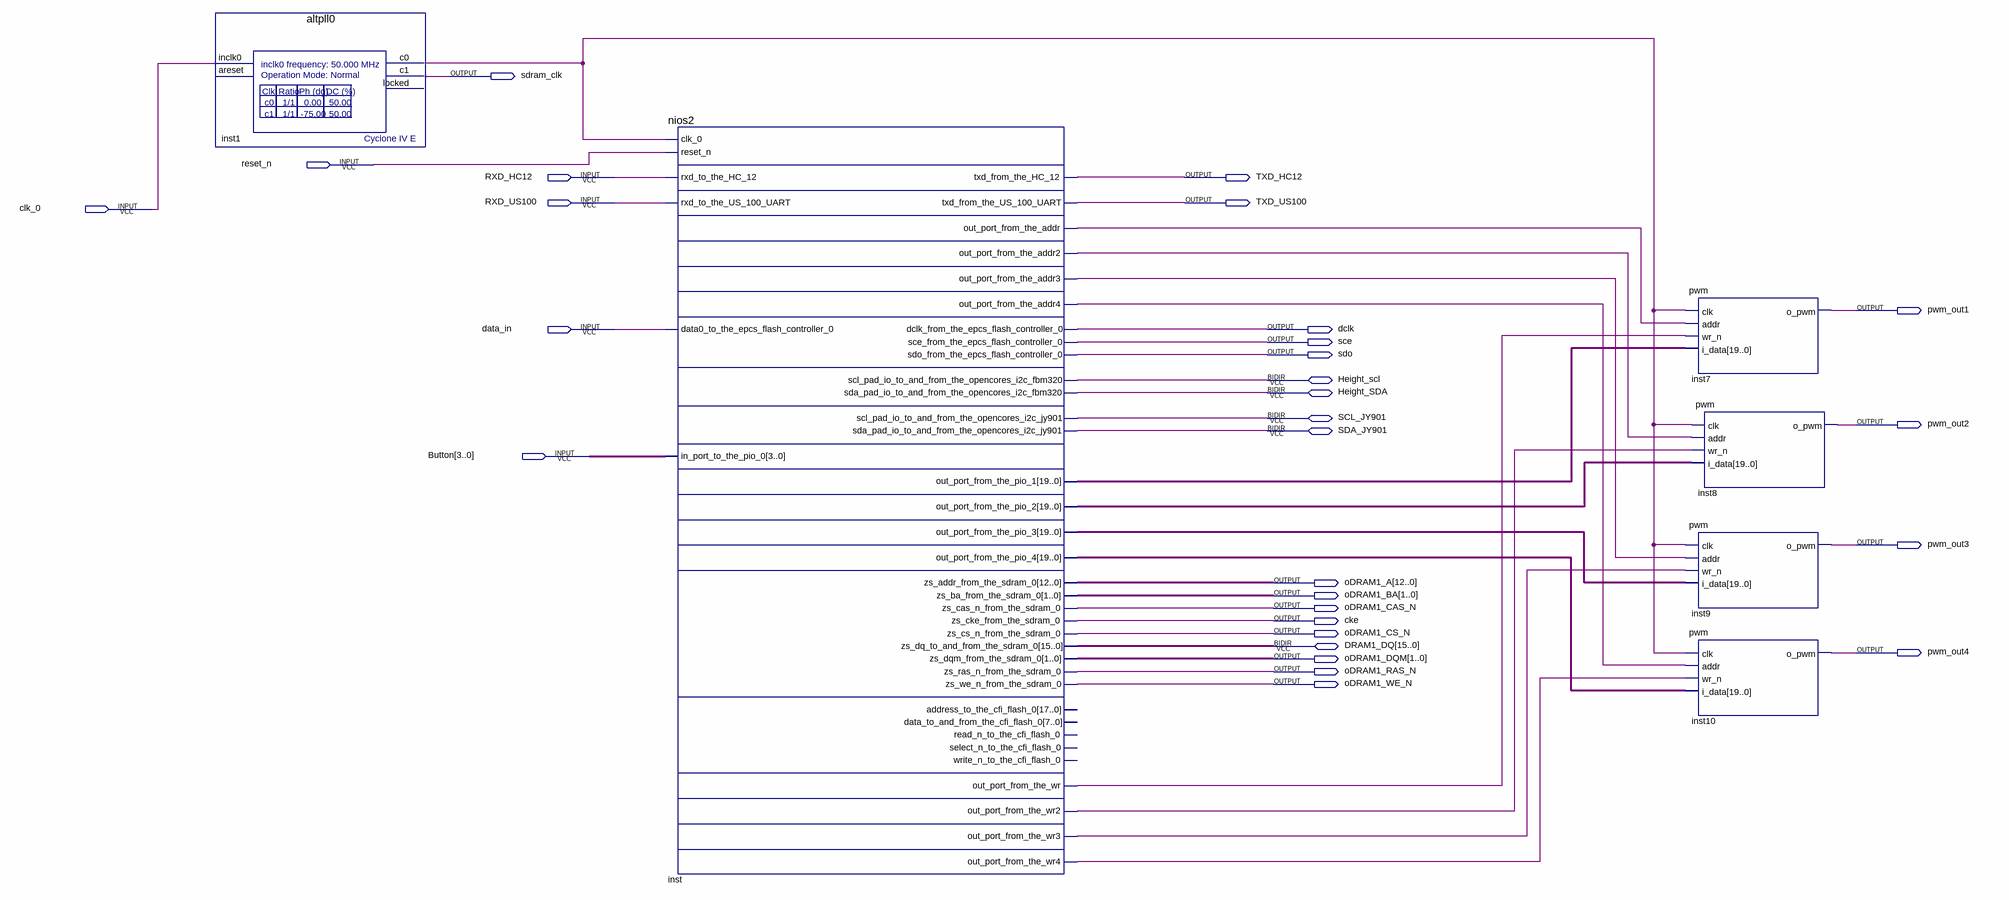
[diagram p0: schematic sheet]
// Quartus schematic UAV.bdf as structural Verilog: 6 symbols, 29 pins
module UAV (
  input  reset_n,
  input  RXD_HC12,
  input  RXD_US100,
  input  clk_0,
  input  data_in,
  input  [3:0] Button,
  inout  Height_scl,
  inout  Height_SDA,
  inout  SCL_JY901,
  inout  SDA_JY901,
  inout  [15:0] DRAM1_DQ,
  output sdram_clk,
  output TXD_HC12,
  output TXD_US100,
  output pwm_out1,
  output dclk,
  output sce,
  output sdo,
  output pwm_out2,
  output pwm_out3,
  output [12:0] oDRAM1_A,
  output [1:0] oDRAM1_BA,
  output oDRAM1_CAS_N,
  output cke,
  output oDRAM1_CS_N,
  output pwm_out4,
  output [1:0] oDRAM1_DQM,
  output oDRAM1_RAS_N,
  output oDRAM1_WE_N
);

  wire inst1_c0, inst_out_port_from_the_addr, inst_out_port_from_the_addr2, inst_out_port_from_the_addr3,
       inst_out_port_from_the_addr4, inst_out_port_from_the_wr, inst_out_port_from_the_wr2,
       inst_out_port_from_the_wr3, inst_out_port_from_the_wr4;
  wire [19:0] inst_out_port_from_the_pio_1, inst_out_port_from_the_pio_2, inst_out_port_from_the_pio_3,
       inst_out_port_from_the_pio_4;

  altpll0 inst1 (.inclk0(clk_0), .c0(inst1_c0), .c1(sdram_clk));  // open: areset, locked
  nios2 inst (
    .clk_0(inst1_c0), .reset_n(reset_n), .rxd_to_the_HC_12(RXD_HC12), .rxd_to_the_US_100_UART(RXD_US100),
    .data0_to_the_epcs_flash_controller_0(data_in), .in_port_to_the_pio_0(Button),
    .txd_from_the_HC_12(TXD_HC12), .txd_from_the_US_100_UART(TXD_US100),
    .out_port_from_the_addr(inst_out_port_from_the_addr),
    .out_port_from_the_addr2(inst_out_port_from_the_addr2),
    .out_port_from_the_addr3(inst_out_port_from_the_addr3),
    .out_port_from_the_addr4(inst_out_port_from_the_addr4), .dclk_from_the_epcs_flash_controller_0(dclk),
    .sce_from_the_epcs_flash_controller_0(sce), .sdo_from_the_epcs_flash_controller_0(sdo),
    .out_port_from_the_pio_1(inst_out_port_from_the_pio_1),
    .out_port_from_the_pio_2(inst_out_port_from_the_pio_2),
    .out_port_from_the_pio_3(inst_out_port_from_the_pio_3),
    .out_port_from_the_pio_4(inst_out_port_from_the_pio_4), .zs_addr_from_the_sdram_0(oDRAM1_A),
    .zs_ba_from_the_sdram_0(oDRAM1_BA), .zs_cas_n_from_the_sdram_0(oDRAM1_CAS_N),
    .zs_cke_from_the_sdram_0(cke), .zs_cs_n_from_the_sdram_0(oDRAM1_CS_N),
    .zs_dqm_from_the_sdram_0(oDRAM1_DQM), .zs_ras_n_from_the_sdram_0(oDRAM1_RAS_N),
    .zs_we_n_from_the_sdram_0(oDRAM1_WE_N), .out_port_from_the_wr(inst_out_port_from_the_wr),
    .out_port_from_the_wr2(inst_out_port_from_the_wr2), .out_port_from_the_wr3(inst_out_port_from_the_wr3),
    .out_port_from_the_wr4(inst_out_port_from_the_wr4),
    .scl_pad_io_to_and_from_the_opencores_i2c_fbm320(Height_scl),
    .sda_pad_io_to_and_from_the_opencores_i2c_fbm320(Height_SDA),
    .scl_pad_io_to_and_from_the_opencores_i2c_jy901(SCL_JY901),
    .sda_pad_io_to_and_from_the_opencores_i2c_jy901(SDA_JY901), .zs_dq_to_and_from_the_sdram_0(DRAM1_DQ));  // open: address_to_the_cfi_flash_0, read_n_to_the_cfi_flash_0, select_n_to_the_cfi_flash_0, write_n_to_the_cfi_flash_0, data_to_and_from_the_cfi_flash_0
  pwm inst7 (
    .clk(inst1_c0), .addr(inst_out_port_from_the_addr), .wr_n(inst_out_port_from_the_wr),
    .i_data(inst_out_port_from_the_pio_1), .o_pwm(pwm_out1));
  pwm inst9 (
    .clk(inst1_c0), .addr(inst_out_port_from_the_addr3), .wr_n(inst_out_port_from_the_wr3),
    .i_data(inst_out_port_from_the_pio_3), .o_pwm(pwm_out3));
  pwm inst10 (
    .clk(inst1_c0), .addr(inst_out_port_from_the_addr4), .wr_n(inst_out_port_from_the_wr4),
    .i_data(inst_out_port_from_the_pio_4), .o_pwm(pwm_out4));
  pwm inst8 (
    .clk(inst1_c0), .addr(inst_out_port_from_the_addr2), .wr_n(inst_out_port_from_the_wr2),
    .i_data(inst_out_port_from_the_pio_2), .o_pwm(pwm_out2));
endmodule
